# Altium schematic sheet GPS.SchDoc: GPS
size A4; Engineer: David; DocumentNumber: 8; SheetNumber: 8; SheetTotal: 9; Project: SmartCanton Dev Box; Labo: LSN; PageSetup: Record=PageOptions|CenterHorizontal=True|CenterVertical=True|PrintScale=0.97|XCorrection=1.00|YCorrection=1.00|PrintKind=1|BorderSize=5000000|LeftOffset=0|BottomOffset=0|Orientation=2|PaperLength=1000|PaperWidth=1000|Scale=100|PaperSource=7|PrintQuality=-3|MediaType=1|DitherType=10|PrintScaleMode=1|PaperKind=A4 (210 x 297 mm)|PaperIndex=9
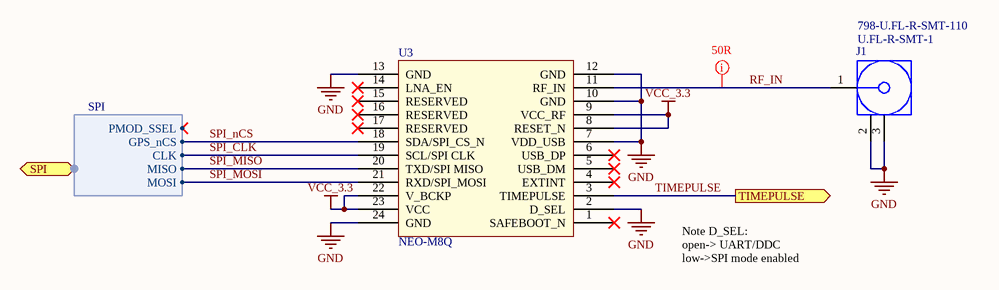
[diagram p0: GPS.SchDoc]

## Parts
J1  U.FL-R-SMT-1  Supplier Part Number 1: 798-U.FL-R-SMT-110  [U.FL-R-SMT-1]
U3  NEO-M8Q  [NEO]

## Ports
SPI (harness SPI), TIMEPULSE (out)

## Harnesses
SPI: CLK, MISO, MOSI, PMOD_SSEL, GPS_nCS

## Nets
GND: J1.2(GND) J1.3(GND) U3.2(D_SEL) U3.7(VDD_USB) U3.10(GND) U3.12(GND) U3.13(GND) U3.24(GND)
VCC_3.3: U3.8(RESET_N) U3.9(VCC_RF) U3.22(V_BCKP) U3.23(VCC)
RF_IN: J1.1(Signal) U3.11(RF_IN)
SPI_CLK: U3.19(SCL/SPI_CLK) ; port SPI.CLK
SPI_MISO: U3.20(TXD/SPI_MISO) ; port SPI.MISO
SPI_MOSI: U3.21(RXD/SPI_MOSI) ; port SPI.MOSI
SPI_nCS: U3.18(SDA/SPI_CS_N) ; port SPI.GPS_nCS
TIMEPULSE: U3.3(TIMEPULSE) ; port TIMEPULSE

Not connected (* = marked no-connect by the designer): U3 1(SAFEBOOT_N)* 4(EXTINT)* 5(USB_DM)* 6(USB_DP)* 14(LNA_EN)* 15(RESERVED)* 16(RESERVED)* 17(RESERVED)*

## Layout directives
net class 50R; rule Clearance Constraint [Clearance = 6.2mil]: RF_IN

## Notes on the sheet
- Note D_SEL:
  open-> UART/DDC
  low->SPI mode enabled
- Title:
- Date:
- Project:
- Engineer:
- Revision:
- Sheet
- of
- Labo:
- File:

## Library data of the parts
J1 = CMP-001-0013-A.3: Hirose U.FL SMT connector; Datasheet: https://www.hirose.com/product/en/download_file/key_name/U.FL/category/Catalog/doc_file_id/31697/?file_category_id=4&item_id=15&is_series=1; Drawing: https://www.hirose.com/product/en/download_file/key_name/U.FL-R-SMT-1%2810%29/category/Drawing%20(2D)/doc_file_id/37627/?file_category_id=6&item_id=03310472210&is_series=; Supplier 1: Mouser
U3 = CMP-001-0105-A.1: u-blox M8 concurrent GNSS LCC module, TCXO, ROM, SAW, LNA